# EAGLE design circuit (EAGLE 6.6.0)

## Sheet 1 of 3
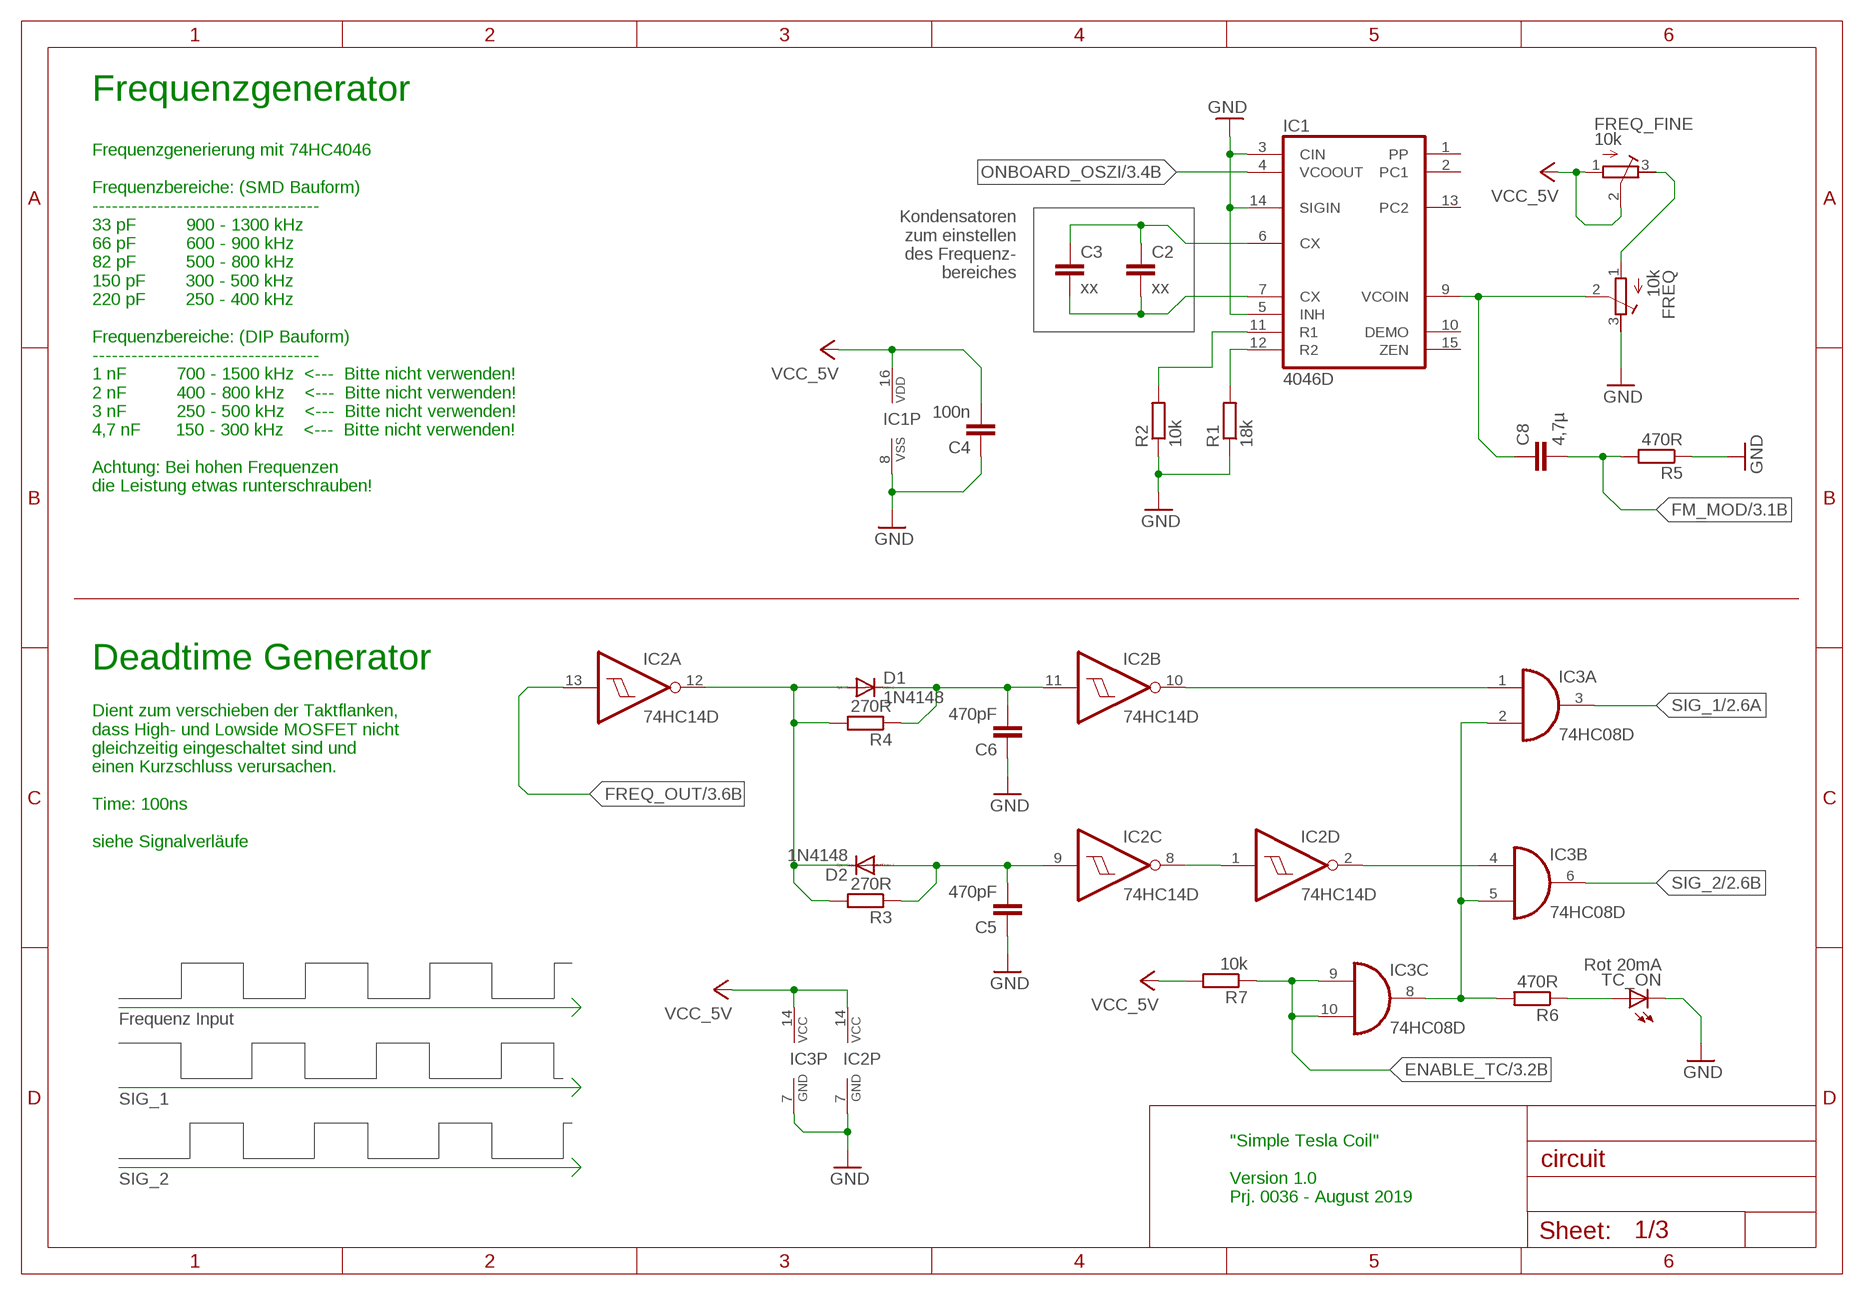
[diagram p0: schematic, sheet 1]

### Parts
C2  xx  C-EUC0805K  [C0805K]
C3  xx  C-EUC0805K  [C0805K]
C4  100n  C-EUC1206K  [C1206K]
C5  470pF  C-EUC1206K  [C1206K]
C6  470pF  C-EUC1206K  [C1206K]
C8  4,7µ  C-EUC1206K  [C1206K]
D1  1N4148  DIODE-SOD323-W  [SOD323-W]
D2  1N4148  DIODE-SOD323-W  [SOD323-W]
FREQ  10k  R-TRIMM64W  [RTRIM64W]
FREQ_FINE  10k  R-TRIMM64W  [RTRIM64W]
IC1  4046D  [SO16]
IC2  74HC14D  74HCT14D  [SO14]
IC3  74HC08D  [SO14]
R1  18k  R-EU_M1206  [M1206]
R2  10k  R-EU_M1206  [M1206]
R3  270R  R-EU_M1206  [M1206]
R4  270R  R-EU_M1206  [M1206]
R5  470R  R-EU_M1206  [M1206]
R6  470R  R-EU_M1206  [M1206]
R7  10k  R-EU_M1206  [M1206]
TC_ON  Rot 20mA  LEDSMT1206  [1206]

### Nets
ENABLE_TC: IC3.9(C:I0) IC3.10(C:I1) R7.1 ; also sheet 3
ENABLE_TC2: IC3.2(A:I1) IC3.5(B:I1) IC3.8(C:O) R6.2
FM_MOD: C8.2 R5.2 ; also sheet 3
FREQ_OUT: IC2.13(A:I) ; also sheet 3
GND: C4.1 C5.1 C6.1 FREQ.3(E) IC1.3(CIN) IC1.5(INH) IC1.8(VSS) IC1.14(SIGIN) IC2.7(P:GND) IC3.7(P:GND) R1.1 R2.1 R5.1 TC_ON.C ; also sheet 2,3
N$1: C2.1 C3.1 IC1.6(CX)
N$2: C2.2 C3.2 IC1.7(CX)
N$3: C5.2 D2.A IC2.9(C:I) R3.1
N$4: C8.1 FREQ.2(S) IC1.9(VCOIN)
N$5: R6.1 TC_ON.A
N$6: IC1.11(R1) R2.2
N$8: IC1.12(R2) R1.2
N$9: D1.A D2.C IC2.12(A:O) R3.2 R4.2
N$10: C6.2 D1.C IC2.11(B:I) R4.1
N$15: IC2.1(D:I) IC2.8(C:O)
N$16: IC2.2(D:O) IC3.4(B:I0)
N$17: IC2.10(B:O) IC3.1(A:I0)
N$18: FREQ.1(A) FREQ_FINE.3(E)
ONBOARD_OSZI: IC1.4(VCOOUT) ; also sheet 3
SIG_1: IC3.3(A:O) ; also sheet 2
SIG_2: IC3.6(B:O) ; also sheet 2
VCC: C4.2 FREQ_FINE.1(A) FREQ_FINE.2(S) IC1.16(VDD) IC2.14(P:VCC) IC3.14(P:VCC) R7.2 ; supply symbol labelled VCC_5V ; also sheet 2,3
Unconnected: IC1.1(PP) IC1.2(PC1) IC1.10(DEMO) IC1.13(PC2) IC1.15(ZEN) IC2.3(E:I) IC2.4(E:O) IC2.5(F:I) IC2.6(F:O) IC3.11(D:O) IC3.12(D:I0) IC3.13(D:I1)

### Notes on the sheet
- Frequenzgenerator
- Kondensatoren
  zum einstellen
  des Frequenz-
  bereiches
- Frequenzgenerierung mit 74HC4046
  
  Frequenzbereiche: (SMD Bauform)
  -----------------------------------
  33 pF          900 - 1300 kHz
  66 pF          600 - 900 kHz
  82 pF          500 - 800 kHz
  150 pF        300 - 500 kHz
  220 pF        250 - 400 kHz
  
  Frequenzbereiche: (DIP Bauform)
  -----------------------------------
  1 nF          700 - 1500 kHz  <---  Bitte nicht verwenden!
  2 nF          400 - 800 kHz    <---  Bitte nicht verwenden!
  3 nF          250 - 500 kHz    <---  Bitte nicht verwenden!
  4,7 nF       150 - 300 kHz    <---  Bitte nicht verwenden!
  
  Achtung: Bei hohen Frequenzen
  die Leistung etwas runterschrauben!
- Deadtime Generator
- Dient zum verschieben der Taktflanken,
  dass High- und Lowside MOSFET nicht
  gleichzeitig eingeschaltet sind und
  einen Kurzschluss verursachen.
  
  Time: 100ns
  
  siehe Signalverläufe
- Frequenz Input
- SIG_1
- SIG_2
- "Simple Tesla Coil"
  
  Version 1.0
  Prj. 0036 - August 2019

## Sheet 2 of 3
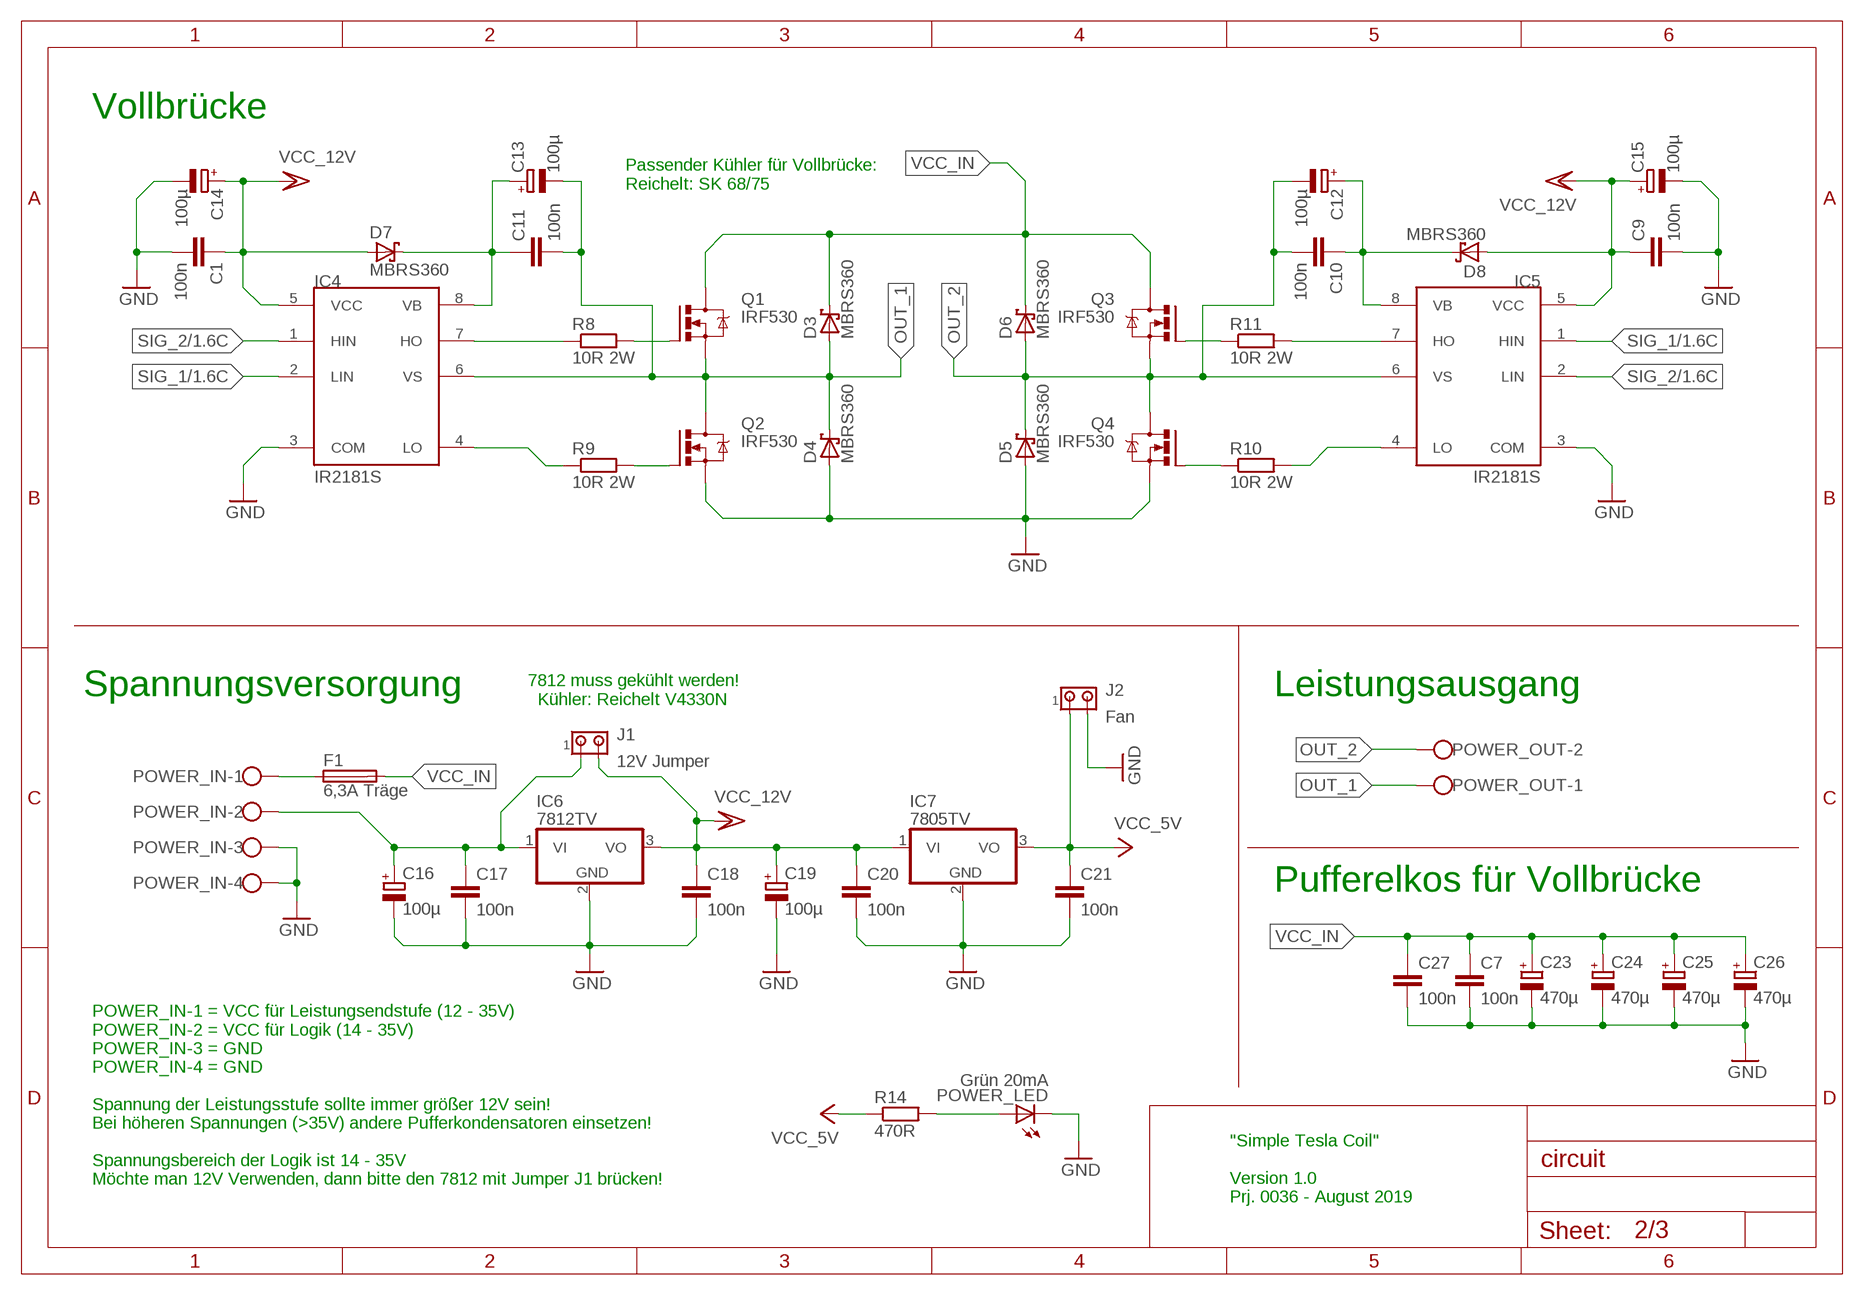
[diagram p1: schematic, sheet 2]

### Parts
C1  100n  C-EUC1206K  [C1206K]
C7  100n  C-EUC1206K  [C1206K]
C9  100n  C-EUC1206K  [C1206K]
C10  100n  C-EUC1206K  [C1206K]
C11  100n  C-EUC1206K  [C1206K]
C12  100µ  CPOL-EUE2.5-7  [E2,5-7]
C13  100µ  CPOL-EUE2.5-7  [E2,5-7]
C14  100µ  CPOL-EUE2.5-7  [E2,5-7]
C15  100µ  CPOL-EUE2.5-7  [E2,5-7]
C16  100µ  CPOL-EUE2.5-7  [E2,5-7]
C17  100n  C-EUC1206K  [C1206K]
C18  100n  C-EUC1206K  [C1206K]
C19  100µ  CPOL-EUE2.5-7  [E2,5-7]
C20  100n  C-EUC1206K  [C1206K]
C21  100n  C-EUC1206K  [C1206K]
C23  470µ  CPOL-EUE5-10.5  [E5-10,5]
C24  470µ  CPOL-EUE5-10.5  [E5-10,5]
C25  470µ  CPOL-EUE5-10.5  [E5-10,5]
C26  470µ  CPOL-EUE5-10.5  [E5-10,5]
C27  100n  C-EUC1206K  [C1206K]
D3  MBRS360  MBRS340T3  [SMC]
D4  MBRS360  MBRS340T3  [SMC]
D5  MBRS360  MBRS340T3  [SMC]
D6  MBRS360  MBRS340T3  [SMC]
D7  MBRS360  MBRS340T3  [SMC]
D8  MBRS360  MBRS340T3  [SMC]
F1  6,3A Träge  SH22,5  [SH22,5]
IC4  IR2181S  [SO08]
IC5  IR2181S  [SO08]
IC6  7812TV  [TO220V]
IC7  7805TV  [TO220V]
J1  12V Jumper  MTA02-100  [10X02MTA]
J2  Fan  MTA02-100  [10X02MTA]
POWER_IN  W237-4  [W237-4]
POWER_LED  Grün 20mA  LEDSMT1206  [1206]
POWER_OUT  W237-102  [W237-102]
Q1  IRF530  [TO220BV]
Q2  IRF530  [TO220BV]
Q3  IRF530  [TO220BV]
Q4  IRF530  [TO220BV]
R8  10R 2W  R-EU_0411/15  [0411/15]
R9  10R 2W  R-EU_0411/15  [0411/15]
R10  10R 2W  R-EU_0411/15  [0411/15]
R11  10R 2W  R-EU_0411/15  [0411/15]
R14  470R  R-EU_M1206  [M1206]

### Nets
GND: C1.2 C7.2 C9.2 C14.- C15.- C16.- C17.2 C18.2 C19.- C20.2 C21.2 C23.- C24.- C25.- C26.- C27.2 D4.A D5.A IC4.3(COM) IC5.3(COM) IC6.2(GND) IC7.2(GND) J2.2 POWER_IN.3 POWER_IN.4 POWER_LED.C Q2.S Q4.S ; also sheet 1,3
N$19: IC4.7(HO) R8.1
N$20: IC4.4(LO) R9.1
N$21: IC5.7(HO) R11.2
N$22: IC5.4(LO) R10.2
N$23: F1.1 POWER_IN.1
N$24: Q3.G R11.1
N$25: Q4.G R10.1
N$26: Q2.G R9.2
N$27: C16.+ C17.1 IC6.1(VI) J1.1 POWER_IN.2
N$28: POWER_LED.A R14.2
N$30: Q1.G R8.2
OUT_1: C11.2 C13.- D3.A D4.C IC4.6(VS) POWER_OUT.1 Q1.S Q2.D
OUT_2: C10.2 C12.- D5.C D6.A IC5.6(VS) POWER_OUT.2 Q3.S Q4.D
SIG_1: IC4.2(LIN) IC5.1(HIN) ; also sheet 1
SIG_2: IC4.1(HIN) IC5.2(LIN) ; also sheet 1
VB: C11.1 C13.+ D7.C IC4.8(VB)
VB_2: C10.1 C12.+ D8.C IC5.8(VB)
VCC: C21.1 IC7.3(VO) J2.1 R14.1 ; supply symbol labelled VCC_5V ; also sheet 1,3
VCC/2: C1.1 C9.1 C14.+ C15.+ C18.1 C19.+ C20.1 D7.A D8.A IC4.5(VCC) IC5.5(VCC) IC6.3(VO) IC7.1(VI) J1.2 ; supply symbol labelled VCC_12V ; also sheet 3
VCC_IN: C7.1 C23.+ C24.+ C25.+ C26.+ C27.1 D3.C D6.C F1.2 Q1.D Q3.D

### Notes on the sheet
- Vollbrücke
- Passender Kühler für Vollbrücke:
  Reichelt: SK 68/75
- Spannungsversorgung | Leistungsausgang
- 7812 muss gekühlt werden!
    Kühler: Reichelt V4330N
- Pufferelkos für Vollbrücke
- POWER_IN-1 = VCC für Leistungsendstufe (12 - 35V)
  POWER_IN-2 = VCC für Logik (14 - 35V)
  POWER_IN-3 = GND
  POWER_IN-4 = GND
  
  Spannung der Leistungsstufe sollte immer größer 12V sein!
  Bei höheren Spannungen (>35V) andere Pufferkondensatoren einsetzen!
   
  Spannungsbereich der Logik ist 14 - 35V
  Möchte man 12V Verwenden, dann bitte den 7812 mit Jumper J1 brücken!
- "Simple Tesla Coil"
  
  Version 1.0
  Prj. 0036 - August 2019

## Sheet 3 of 3
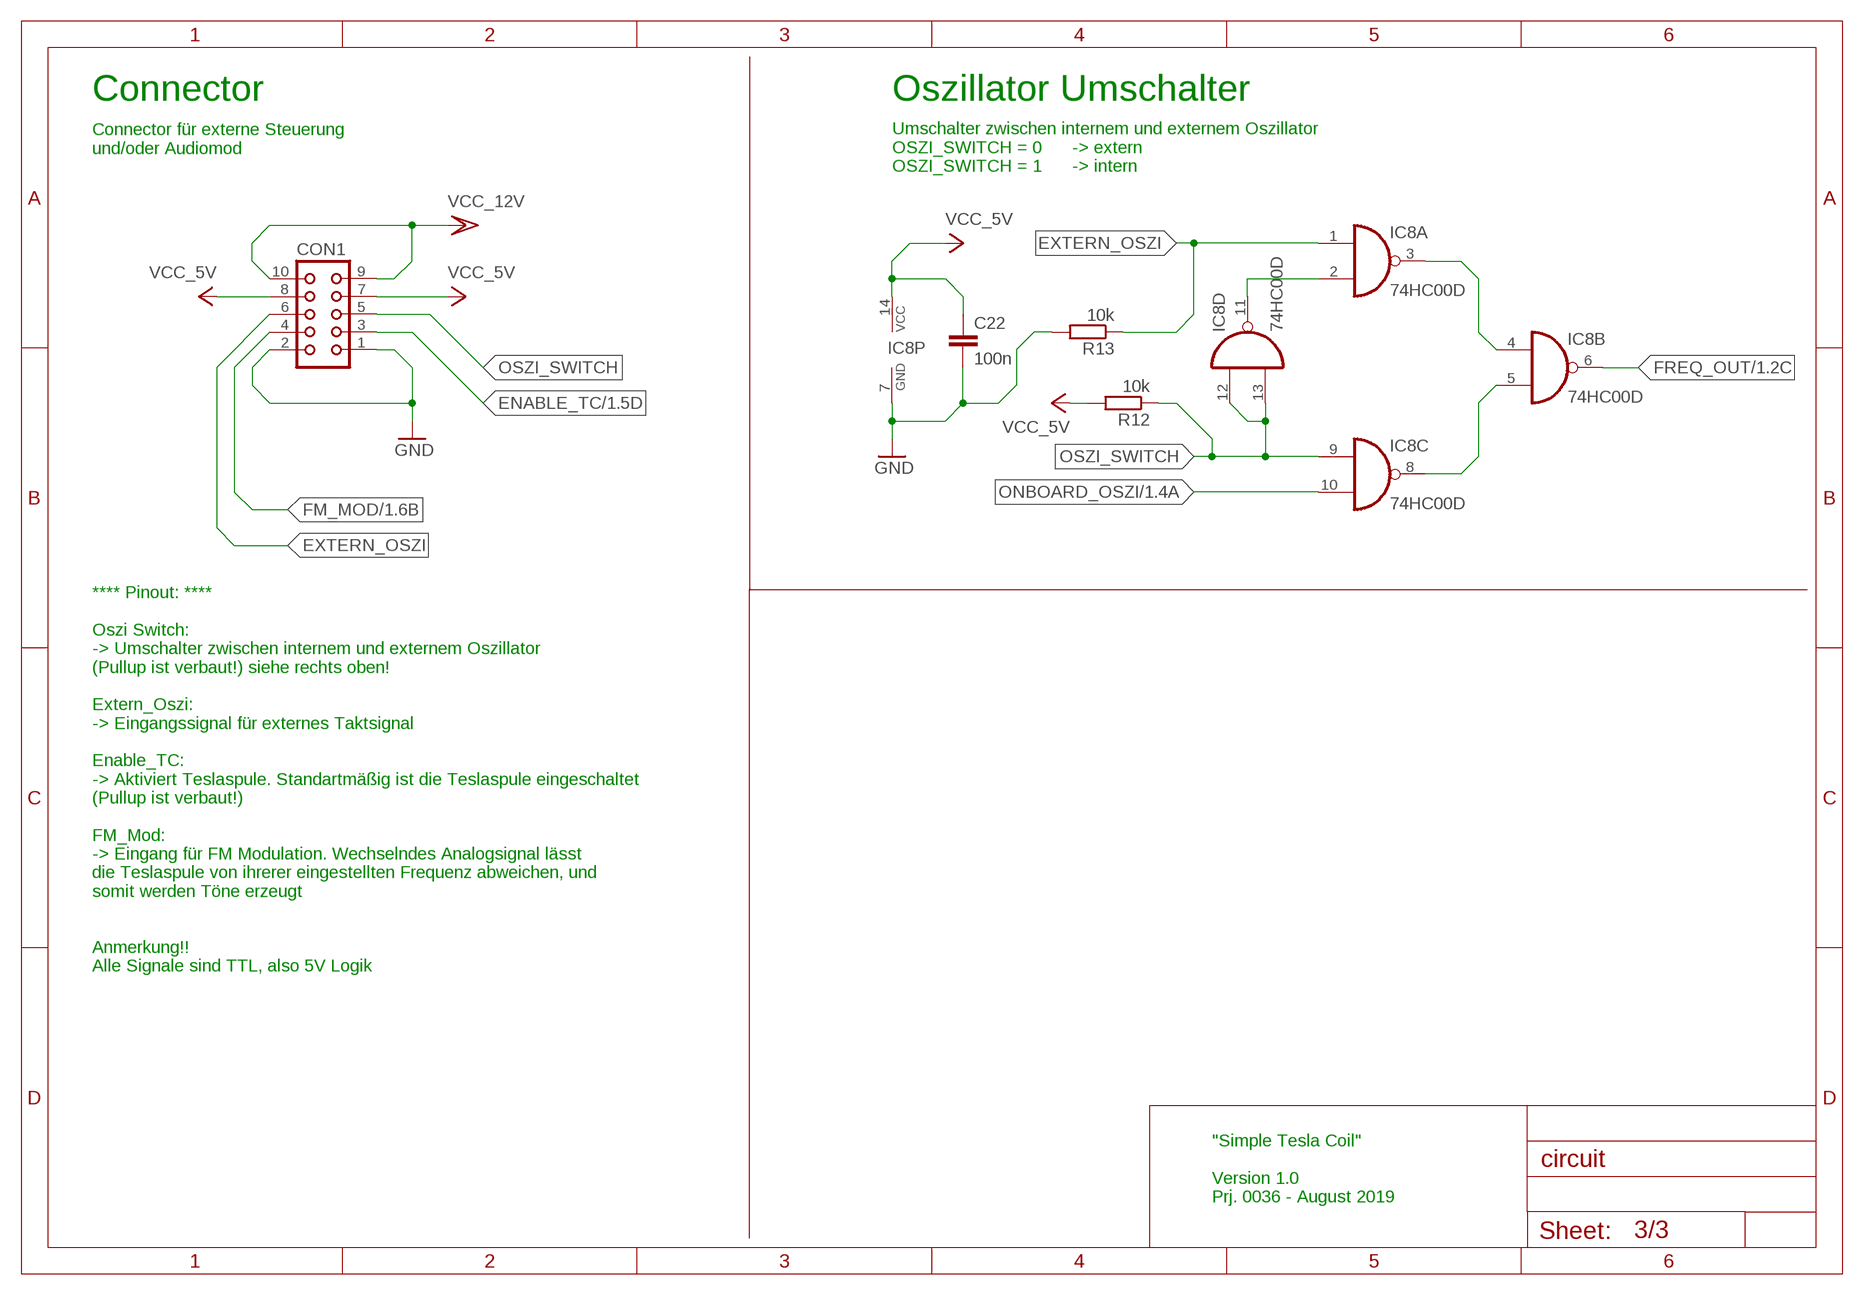
[diagram p2: schematic, sheet 3]

### Parts
C22  100n  C-EUC1206K  [C1206K]
CON1  CON10  [CON10]
IC8  74HC00D  [SO14]
R12  10k  R-EU_M1206  [M1206]
R13  10k  R-EU_M1206  [M1206]

### Nets
ENABLE_TC: CON1.3 ; also sheet 1
EXTERN_OSZI: CON1.6 IC8.1(A:I0) R13.1
FM_MOD: CON1.4 ; also sheet 1
FREQ_OUT: IC8.6(B:O) ; also sheet 1
GND: C22.2 CON1.1 CON1.2 IC8.7(P:GND) R13.2 ; also sheet 1,2
N$29: IC8.2(A:I1) IC8.11(D:O)
N$31: IC8.3(A:O) IC8.4(B:I0)
N$32: IC8.5(B:I1) IC8.8(C:O)
ONBOARD_OSZI: IC8.10(C:I1) ; also sheet 1
OSZI_SWITCH: CON1.5 IC8.9(C:I0) IC8.12(D:I0) IC8.13(D:I1) R12.1
VCC: C22.1 CON1.7 CON1.8 IC8.14(P:VCC) R12.2 ; supply symbol labelled VCC_5V ; also sheet 1,2
VCC/2: CON1.9 CON1.10 ; supply symbol labelled VCC_12V ; also sheet 2

### Notes on the sheet
- Connector | Oszillator Umschalter
- Connector für externe Steuerung
  und/oder Audiomod
- Umschalter zwischen internem und externem Oszillator
  OSZI_SWITCH = 0      -> extern
  OSZI_SWITCH = 1      -> intern
- **** Pinout: ****
  
  Oszi Switch:
  -> Umschalter zwischen internem und externem Oszillator
  (Pullup ist verbaut!) siehe rechts oben!
  
  Extern_Oszi:
  -> Eingangssignal für externes Taktsignal
  
  Enable_TC:
  -> Aktiviert Teslaspule. Standartmäßig ist die Teslaspule eingeschaltet 
  (Pullup ist verbaut!)
  
  FM_Mod:
  -> Eingang für FM Modulation. Wechselndes Analogsignal lässt
  die Teslaspule von ihrerer eingestellten Frequenz abweichen, und
  somit werden Töne erzeugt
  
  
  Anmerkung!!
  Alle Signale sind TTL, also 5V Logik
- "Simple Tesla Coil"
  
  Version 1.0
  Prj. 0036 - August 2019

## Library data of the parts
C1-C11 C17 C18 C20-C22 C27 = rcl:C-EU: CAPACITOR, European symbol
C12-C16 C19 C23-C26 = rcl:CPOL-EU: POLARIZED CAPACITOR, European symbol
CON1 = con-harting:CON10: CONNECTOR; OC_FARNELL: unknown; OC_NEWARK: unknown
D1 D2 = diode:DIODE-: DIODE
D3-D8 = diode:MBRS3*0T3: SCHOTTKY BARRIER RECTIFIER 3.0 AMPERES 20, 30, 40 VOLT Source: MBRS340T3-D.pdf
F1 = fuse:SH22,5: FUSE HOLDER grid 22,5 mm, OGN0031 8201, Schurter (Buerklin); MF: SCHURTER; MPN: 0031.8201; OC_FARNELL: 1162740; OC_NEWARK: 96F8317
FREQ FREQ_FINE = rcl:R-TRIMM: Trimm resistor
IC1 = 40xx:4046: Micropower PLL
IC2 = 74xx-eu:74*14: Hex schmitt trigger INVERTER
IC3 = 74xx-eu:74*08: Quad 2-input AND gate
IC4 IC5 = _irs:IR2181
IC6 IC7 = linear:78*: Positive VOLTAGE REGULATOR Source: http://cache.national.com/ds/LM/LM78L05.pdf http://www.fairchildsemi.com/ds/LM/LM7805.pdf
IC8 = 74xx-eu:74*00: Quad 2-input NAND gate
J1 J2 = con-amp:MTA02-100: AMP connector
POWER_IN = con-wago-500:W237-4: WAGO SCREW CLAMP; OC_FARNELL: unknown; OC_NEWARK: unknown
POWER_LED TC_ON = led:LED: LED OSRAM: - CHIPLED LG R971, LG N971, LY N971, LG Q971, LY Q971, LO R971, LY R971 LH N974, LH R974 LS Q976, LO Q976, LY Q976 LO Q996 - Hyper CHIPLED LW Q18S LB Q993, LB Q99A, LB R99A - SideLED LS A670, LO A670, LY A670, LG A670, LP A670 LB A673, LV A673, LT A673, LW A673 LH A674 LY A675 LS A676, LA A676, LO A676, LY A676, LW A676 LS A679, LY A679, LG A679 - Hyper Micro SIDELED® LS Y876, LA Y876, LO Y876, LY Y876 LT Y87S - SmartLED LW L88C, LW L88S LB L89C, LB L89S, LG L890 LS L89K, LO L89K, LY L89K LS L896, LA L896, LO L896, LY L896 - TOPLED LS T670, LO T670, LY T670, LG T670, LP T670 LSG T670, LSP T670, LSY T670, LOP T670, LYG T670 LG T671, LOG T671, LSG T671 LB T673, LV T673, LT T673, LW T673 LH T674 LS T676, LA T676, LO T676, LY T676, LB T676, LH T676, LSB T676, LW T676 LB T67C, LV T67C, LT T67C, LS T67K, LO T67K, LY T67K, LW E67C LS E67B, LA E67B, LO E67B, LY E67B, LB E67C, LV E67C, LT E67C LW T67C LS T679, LY T679, LG T679 LS T770, LO T770, LY T770, LG T770, LP T770 LB T773, LV T773, LT T773, LW T773 LH T774 LS E675, LA E675, LY E675, LS T675 LS T776, LA T776, LO T776, LY T776, LB T776 LHGB T686 LT T68C, LB T68C - Hyper Mini TOPLED® LB M676 - Mini TOPLED Santana® LG M470 LS M47K, LO M47K, LY M47K Source: http://www.osram.convergy.de LUXEON: - LUMILED® LXK2-PW12-R00, LXK2-PW12-S00, LXK2-PW14-U00, LXK2-PW14-V00 LXK2-PM12-R00, LXK2-PM12-S00, LXK2-PM14-U00 LXK2-PE12-Q00, LXK2-PE12-R00, LXK2-PE12-S00, LXK2-PE14-T00, LXK2-PE14-U00 LXK2-PB12-K00, LXK2-PB12-L00, LXK2-PB12-M00, LXK2-PB14-N00, LXK2-PB14-P00, LXK2-PB14-Q00 LXK2-PR12-L00, LXK2-PR12-M00, LXK2-PR14-Q00, LXK2-PR14-R00 LXK2-PD12-Q00, LXK2-PD12-R00, LXK2-PD12-S00 LXK2-PH12-R00, LXK2-PH12-S00 LXK2-PL12-P00, LXK2-PL12-Q00, LXK2-PL12-R00 Source: www.luxeon.com KINGBRIGHT: KA-3528ASYC Source: www.kingbright.com
POWER_OUT = con-wago-500:W237-102: WAGO SCREW CLAMP; MPN: 237-102; OC_FARNELL: unknown; OC_NEWARK: 70K9898
Q1-Q4 = transistor-power:IRF530: HEXFET Power MOSFET
R1-R14 = rcl:R-EU_: RESISTOR, European symbol

## Board
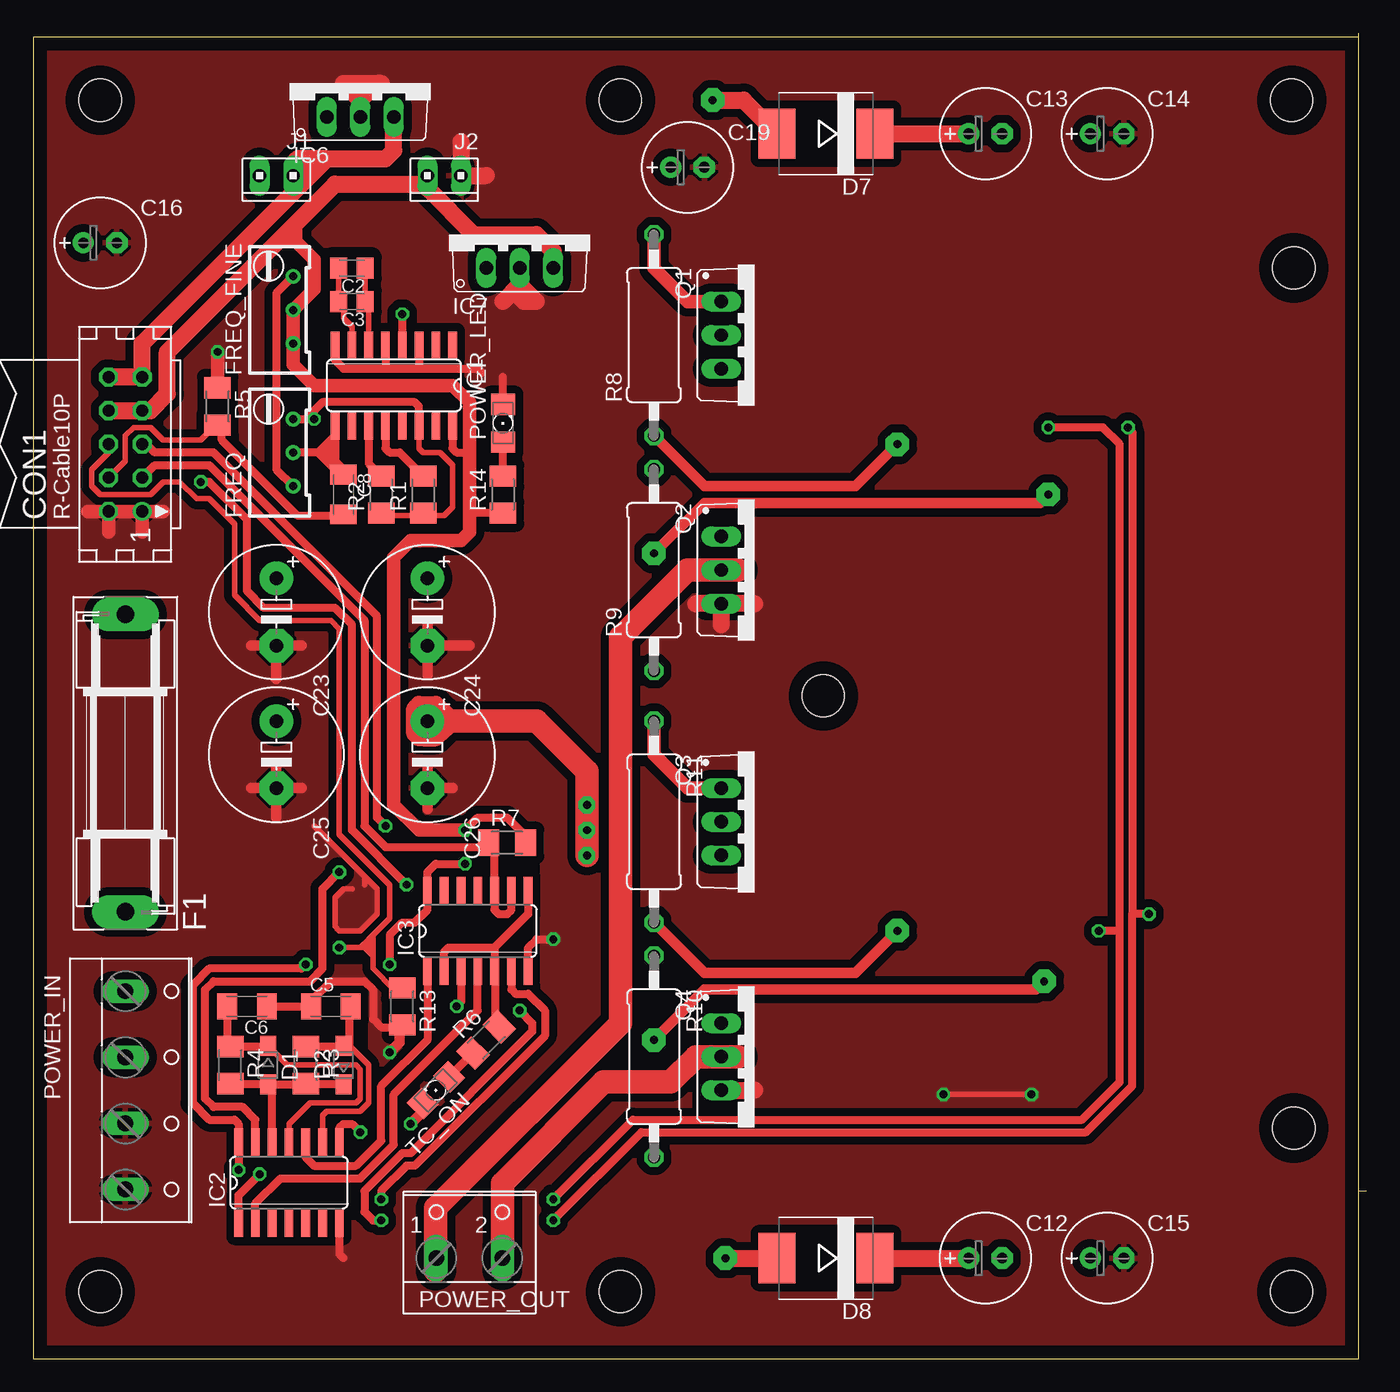
[diagram p3: board, top side]
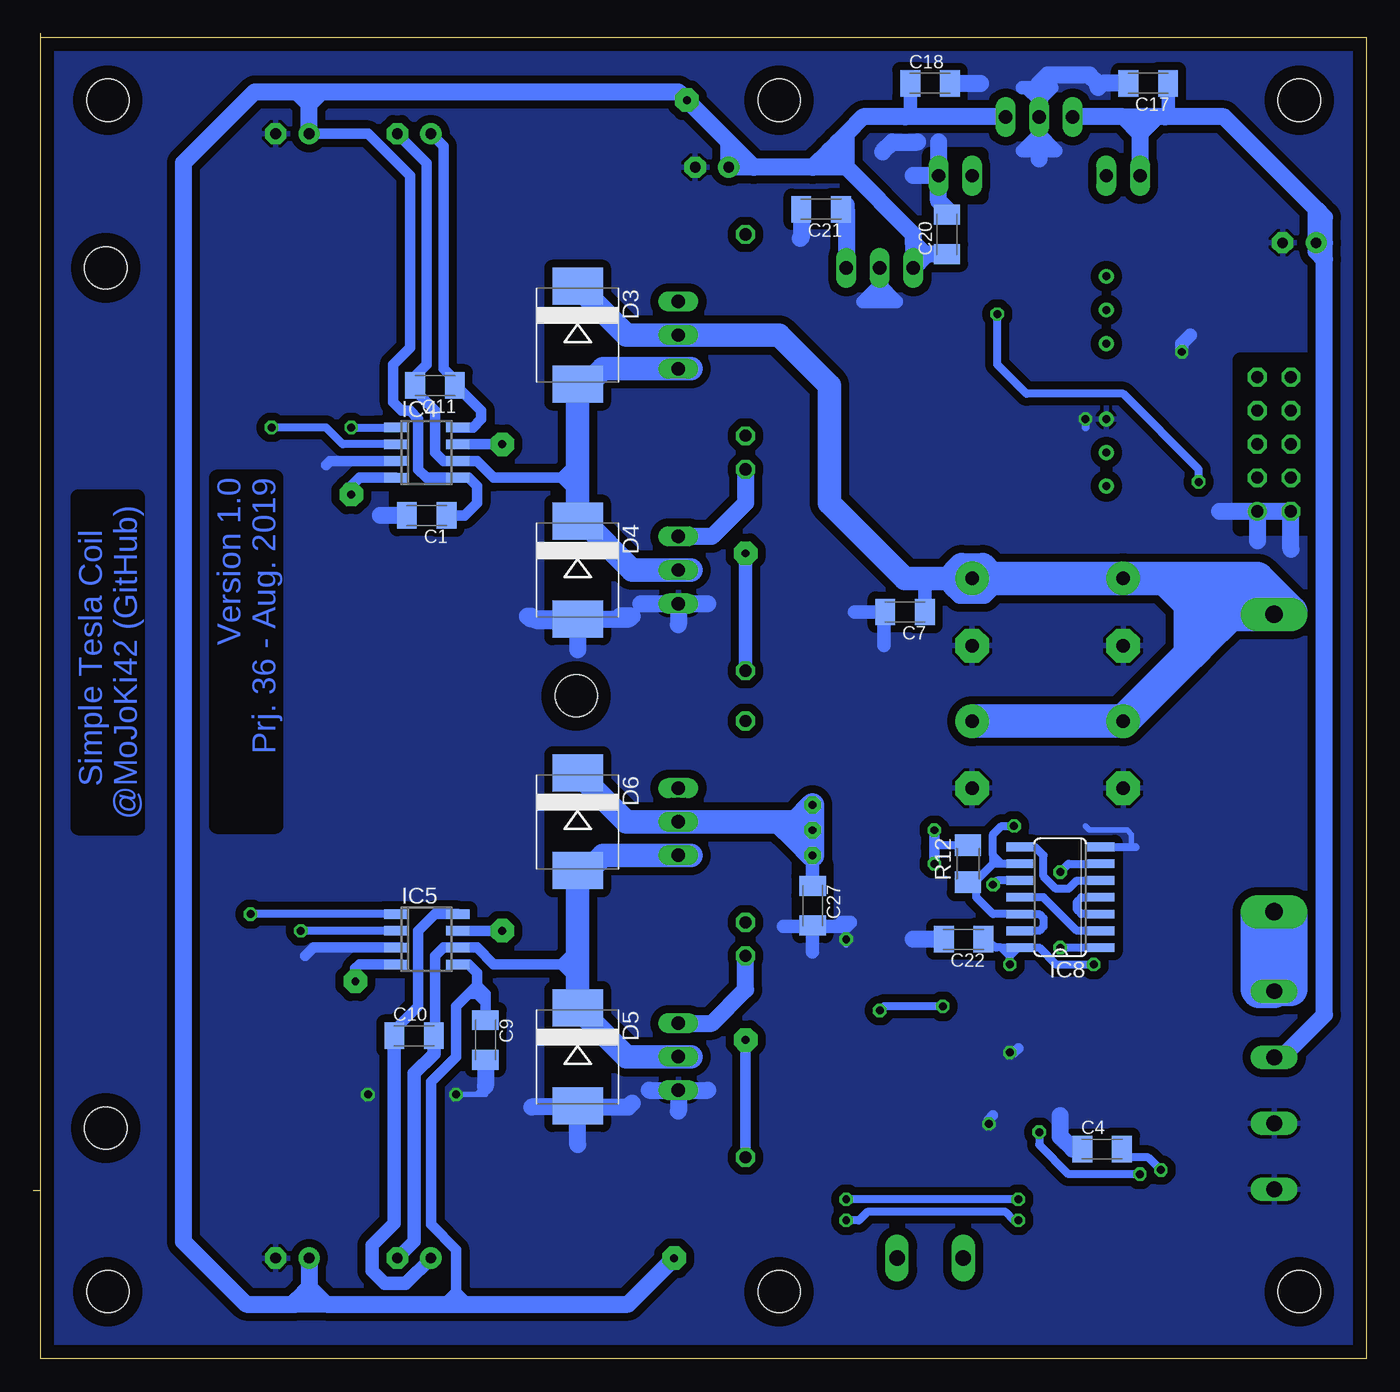
[diagram p4: board, bottom side, seen from below]

Size 100.91 x 100.33 mm. Coordinates in mm from the lower left corner, seen from the top.
Outline: 100.31,100 0,100 0,0 100.33,0 100.33,100.33
Outline: 100.91,12.7 100.33,12.7 100.33,87.7
Copper layers (1*16): Top 0.035mm / dielectric 1.5mm / Bottom 0.035mm
Design rules "default": minimum track width 10mil, minimum drill 24mil, track to track 8mil, track to pad 8mil, pad to pad 8mil, via to via 8mil, smd to smd 8mil, copper to edge 40mil, drill to drill 8mil, minimum pad ring 10mil, minimum via ring 8mil, stop-mask expansion 4mil, vias tented up to drill 0mil, thermal gap 10mil
Holes 3.2 mm at 5.08,95.25 5.08,5.08 95.25,5.08 95.25,95.25 44.45,5.08 44.45,95.25 95.41,82.55 95.41,17.46 59.81,50.16
tRestrict: area 22.5,69.5 to 32.1,77.8; area 33.7,81.3 to 40,83.8; area 50.8,74.3 to 53.3,80.6; area 50.8,56.5 to 53.3,62.9; area 50.8,37.5 to 53.3,43.8; area 50.8,19.7 to 53.3,26; area 21.6,92.7 to 27.9,95.2; area 29.5,28.3 to 37.8,36.5; area 15.2,9.2 to 23.5,17.5; area 54.9,90.8 to 65.1,94.6; area 54.9,5.7 to 65.1,9.5; area 13,69.8 to 14.9,74.3; 13 more areas
bRestrict: area 3.8,62.9 to 9.5,75.6; area 19.1,30.8 to 27.3,39.1; area 28.3,30.8 to 32.7,32.7; area 29.2,35.2 to 31.1,39.7; area 14.3,95.6 to 18.7,97.5; area 30.8,95.6 to 35.2,97.5; area 39.1,86 to 43.5,87.9; area 57.8,72.4 to 61.6,82.5; area 68.9,62.9 to 73.3,64.8; area 72.7,66.4 to 74.9,70.8; area 57.8,54.6 to 61.6,64.8; area 57.8,35.6 to 61.6,45.7; 13 more areas

### Footprints (pad centres in the part's own frame; a part is rotated, then mirrored left to right if it is on the bottom)
C1206K = smd 1.5 x 2: 1 -1.5,0; 2 1.5,0
C0805K = smd 1.3 x 1.6: 1 -1,0; 2 1,0
E2,5-7 = drill 0.813 pad 1.6: + -1.27,0 | drill 0.813 pad 1.6 octagon: - 1.27,0
E5-10,5 = drill 1.016 pad 2.54: + -2.54,0 | drill 1.016 pad 2.54 octagon: - 2.54,0
CON10 = drill 0.914: 1 -5.08,-1.27 | drill 0.914 octagon: 2 -5.08,1.27; 3 -2.54,-1.27; 4 -2.54,1.27; 5 0,-1.27; 6 0,1.27; 7 2.54,-1.27; 8 2.54,1.27; 9 5.08,-1.27; 10 5.08,1.27
SOD323-W = smd 1.5 x 1.2: A 1.45,0; C -1.45,0
SMC = smd 2.8 x 3.8: A 3.7,0; C -3.7,0
SH22,5 = drill 1.321 pad 2.54 long: 1 -11.252,0; 2 11.252,0
RTRIM64W = drill 0.61: 1 1.27,-2.54; 2 1.27,0; 3 1.27,2.54
SO16 = smd 0.66 x 2.032: 1 -4.445,-3.073; 2 -3.175,-3.073; 3 -1.905,-3.073; 4 -0.635,-3.073; 5 0.635,-3.073; 6 1.905,-3.073; 7 3.175,-3.073; 8 4.445,-3.073; 9 4.445,3.073; 10 3.175,3.073; 11 1.905,3.073; 12 0.635,3.073; 13 -0.635,3.073; 14 -1.905,3.073; 15 -3.175,3.073; 16 -4.445,3.073
SO14 = smd 0.66 x 2.032: 1 -3.81,-3.073; 2 -2.54,-3.073; 3 -1.27,-3.073; 4 0,-3.073; 5 1.27,-3.073; 6 2.54,-3.073; 7 3.81,-3.073; 8 3.81,3.073; 9 2.54,3.073; 10 1.27,3.073; 11 0,3.073; 12 -1.27,3.073; 13 -2.54,3.073; 14 -3.81,3.073
SO08 = smd 0.72 x 1.78: 1 -1.905,-2.35; 2 -0.635,-2.35; 3 0.635,-2.35; 4 1.905,-2.35; 5 1.905,2.35; 6 0.635,2.35; 7 -0.635,2.35; 8 -1.905,2.35
TO220V = drill 1.016 long: 1 -2.54,-2.54; 2 0,-2.54; 3 2.54,-2.54
10X02MTA = drill 1.016 long: 1 1.27,0; 2 -1.27,0
W237-4 = drill 1.194 long: 1 -7.5,-1.27; 2 -2.5,-1.27; 3 2.5,-1.27; 4 7.5,-1.27
1206 = smd 1.6 x 1.803: A -1.422,0; C 1.422,0
W237-102 = drill 1.194 long: 1 -2.5,-1.27; 2 2.5,-1.27
TO220BV = drill 1.016 long: D 0,-2.54; G -2.54,-2.54; S 2.54,-2.54
M1206 = smd 1.6 x 2: 1 -1.4,0; 2 1.4,0
0411/15 = drill 0.914 octagon: 1 -7.62,0; 2 7.62,0

### Placement (x,y rotation side)
C1  71.12,63.82 180 bottom
C2  24.13,82.55 180 top
C3  24.13,80.01 180 top
C4  20,15.88 0 bottom
C5  22.54,26.67 0 top
C6  16.19,26.67 180 top
C7  34.92,56.52 180 bottom
C8  23.5,65.41 270 top
C9  66.67,24.13 270 bottom
C10  72.07,24.45 0 bottom
C11  70.48,73.66 180 bottom
C12  72.07,7.62 0 top
C13  72.07,92.71 0 top
C14  81.28,92.71 0 top
C15  81.28,7.62 0 top
C16  5.08,84.45 0 top
C17  16.51,96.52 180 bottom
C18  33.02,96.52 0 bottom
C19  49.53,90.17 0 top
C20  31.75,85.09 90 bottom
C21  41.27,87 180 bottom
C22  30.48,31.75 180 bottom
C23  18.41,56.52 270 top
C24  29.84,56.52 270 top
C25  18.41,45.72 270 top
C26  29.84,45.72 270 top
C27  41.91,34.29 270 bottom
CON1  6.99,69.22 90 top
D1  17.78,22.23 270 top
D2  23.5,22.23 90 top
D3  59.69,77.47 270 bottom
D4  59.69,59.69 270 bottom
D5  59.69,22.86 270 bottom
D6  59.69,40.64 270 bottom
D7  60.01,92.71 180 top
D8  60.01,7.62 180 top
F1  6.99,45.09 90 top
FREQ  18.41,68.58 0 top
FREQ_FINE  18.41,79.38 0 top
IC1  27.3,73.66 180 top
IC2  19.37,13.34 0 top
IC3  33.66,32.38 0 top
IC4  71.12,68.58 270 bottom
IC5  71.12,31.75 270 bottom
IC6  24.77,96.52 0 top
IC7  36.83,85.09 0 top
IC8  23.18,34.92 90 bottom
J1  18.41,89.53 180 top
J2  31.11,89.53 180 top
POWER_IN  8.26,20.32 270 top
POWER_LED  35.56,70.8 90 top
POWER_OUT  33.02,8.89 0 top
Q1  54.61,77.47 270 top
Q2  54.61,59.69 270 top
Q3  54.61,40.64 270 top
Q4  54.61,22.86 270 top
R1  29.53,65.41 90 top
R2  26.35,65.41 90 top
R3  20.64,22.23 270 top
R4  14.92,22.23 270 top
R5  13.97,72.07 270 top
R6  34.29,24.13 45 top
R7  35.88,39.05 0 top
R8  46.99,77.47 90 top
R9  46.99,59.69 90 top
R10  46.99,22.86 270 top
R11  46.99,40.64 270 top
R12  30.16,37.47 90 bottom
R13  27.94,26.67 270 top
R14  35.56,65.41 90 top
TC_ON  30.48,20.32 225 top

### Tracks (layer width: path | path; a pad name or v marks a point on that pad's centre or on a via)
ENABLE_TC
  Top 0.61: IC3.9 36.2,33.97 35.88,33.66 35.24,33.66 34.92,33.97 IC3.10 34.92,38.42 | 34.92,38.42 34.92,38.6 R7.1 | 34.92,38.42 34.61,38.73 26.67,38.73 25.08,40.32 25.08,55.88 13.34,67.63 9.21,67.63 CON1.3
ENABLE_TC2
  Top 0.61: IC3.8 37.47,33.66 34.92,31.11 | 34.92,31.11 IC3.5 34.96,29.27 34.96,25.12 R6.2 | IC3.2 31.11,30.8 31.43,31.11 34.92,31.11
EXTERN_OSZI  (via drill 0.6)
  Top 0.406: CON1.6 5.71,68.58 4.45,67.31 4.45,66.04 5.08,65.41 8.89,65.41 9.84,66.36 11.11,66.36 12.38,65.09 13.34,65.09 15.24,63.18 15.24,57.78 17.14,55.88 22.54,55.88 23.18,55.24 23.18,39.69 26.99,35.88 26.99,33.34 25.72,32.07 | 25.72,31.11 25.4,31.11 | 25.08,31.11 24.77,31.11 | 24.77,31.11 v23.18,31.11 | 25.72,30.48 25.72,31.11 | 25.72,31.75 25.72,32.07 | 25.08,31.11 25.72,31.75 | 25.72,31.75 25.72,31.11 | 25.72,30.48 25.08,31.11 | 25.08,31.11 25.4,31.11 | 25.4,31.11 25.4,31.75 | 25.4,31.75 25.72,32.07 | 25.4,31.75 24.77,31.11 | 25.72,30.48 25.72,29.53 27.3,27.94 27.81,27.94 R13.1
  Bottom 0.61: v23.18,31.11 IC8.1
FM_MOD
  Top 0.406: CON1.4 6.99,67.94 6.99,69.85 7.62,70.48 8.89,70.48 9.84,69.53 12.7,69.53 13.34,70.17 13.46,70.17 R5.2 13.78,70.48
  Top 0.61: 14.42,70.67 R5.2 14.29,70.36 14.29,69.53 20,63.82 23.41,63.82 C8.2
FREQ_OUT  (via drill 0.6)
  Top 0.61: IC2.13 16.83,18.1 15.88,19.05 13.65,19.05 13.02,19.68 13.02,27.94 13.65,28.57 20.95,28.57 21.91,29.53 21.91,35.56 v23.18,36.83
  Bottom 0.61: v23.18,36.83 22.54,37.47 IC8.6
GND  (via drill 0.6)
  Top 0.406: R13.2 27.75,25.27 | 21.27,27.3 21.27,26.9 C5.1 | IC1.14 29.21,68.9 29.53,68.58 30.8,68.58 31.75,67.63 31.75,64.45 31.11,63.82 30.16,63.82 | 30.16,63.82 26.54,63.82 R2.1 | R1.1 29.98,64 30.16,63.82 | v68.9,20 v75.56,20 | 21.27,40.32 25.08,36.51 | 25.08,36.51 25.08,35.88 | 25.08,36.51 26.04,35.56 26.04,33.66 24.77,32.38 23.18,32.38 22.86,32.7 22.86,34.92 23.5,35.56 24.13,35.56
  Top 0.61: C6.1 C5.1 | 21.27,27.3 22.54,28.57 25.08,28.57 25.72,27.94 25.72,25.72 26.35,25.08 27.75,25.08 R13.2 | FREQ.3 20.64,71.12 | IC1.8 22.86,75.56 23.5,74.93 26.67,74.93 | 26.67,74.93 29.21,74.93 | 29.21,74.93 33.66,74.93 33.97,74.61 | IC1.3 29.21,74.93 | IC1.5 26.67,74.93 | POWER_LED.C 35.56,74.3 | IC1.14 29.21,72.07 28.89,72.39 21.91,72.39 21.27,71.75 | IC2.7 23.18,7.94 23.5,7.62 | 21.27,71.75 20.64,71.12 | 20.64,71.12 v21.27,71.12 21.27,71.75 | IC3.7 37.47,31.11 38.1,31.75 v39.37,31.75
  Top 0.813: 27.75,25.08 27.75,23.94 v26.99,23.18 | TC_ON.C 29.47,18.68 v28.57,17.78 | 29.84,41.59 C26.- | C26.- 29.84,45.09 | C26.- 31.75,43.18 | 16.51,43.18 20.32,43.18 | 18.41,40.96 18.41,45.09 | 16.51,53.98 C23.- | C23.- 20.32,53.98 | C24.- 33.02,53.98 | 29.84,51.75 C24.- | C24.- 29.84,55.88 | 18.41,51.44 C23.-
  Top 1.016: R5.1 v13.97,76.2 | CON1.2 4.13,64.14 | 9.84,64.14 CON1.1 | 8.26,62.55 CON1.1 | CON1.1 CON1.2 | CON1.2 5.71,62.55
  Top 1.27: IC6.2 24.77,95.25 | 24.77,96.52 24.77,95.25 | 24.77,95.25 23.5,96.52 26.04,96.52 | 26.35,96.52 26.04,96.52 | 26.04,96.52 24.77,95.25 | IC7.2 36.83,81.28 | 35.56,80.01 36.83,81.28 | 36.83,81.28 38.1,80.01 37.15,80.01 36.83,80.33 | Q2.S 50.16,57.15 | 54.61,57.15 Q2.S | Q2.S 52.07,55.56 | Q4.S 54.61,20.32 | 32.38,92.08 J2.2 34.29,89.53
  Bottom 0.406: 66.67,22.23 66.67,20 67.31,20 | 66.67,22.54 66.67,20.64 67.31,20 | 67.31,20 v68.9,20 | 17.78,38.73 17.78,39.69 18.1,40.01 20.95,40.01 21.27,40.32
  Bottom 0.61: IC8.7 17.78,38.73 17.46,38.73 | v21.27,71.12 21.27,70.48 | v39.37,31.75 39.37,31.43
  Bottom 0.813: 73.03,67.94 IC4.3 78.42,67.94 78.74,67.63 | 73.03,31.11 IC5.3 79.69,31.11 80.33,30.48 | 36.83,81.28 36.83,80.64 | v26.99,23.18 26.67,23.18 26.35,23.5 | v28.57,17.78 28.57,18.1 28.26,18.41
  Bottom 1.016: v13.97,76.2 13.97,76.83 13.34,77.47 | 24.77,92.71 26.04,91.44 23.5,91.44 24.77,92.71 | 24.77,92.71 24.77,95.25 | 24.77,95.25 23.81,96.2 25.72,96.2 | 26.04,96.2 25.72,96.2 | 25.72,96.2 24.77,95.25 | C7.2 36.51,56.52 | 38.73,56.52 36.51,56.52 | 36.51,56.52 36.51,56.2 | 36.51,53.98 36.51,56.2 | 36.51,56.2 36.2,56.52 | C27.2 41.91,32.7 | 41.91,30.8 41.91,32.7 | 41.91,32.7 40.01,32.7 | 40.01,32.7 39.37,32.7 39.05,33.02 39.69,33.02 40.01,32.7 | 41.91,32.7 44.13,32.7 | 36.83,81.28 35.56,80.01 38.1,80.01 36.83,81.28
  Bottom 1.27: CON1.1 11.11,64.14 | 5.71,61.28 CON1.2 CON1.1 | CON1.1 8.26,61.91 | C17.2 20,96.52 20.32,96.2 20.32,96.52 20.95,97.16 24.13,97.16 24.77,96.52 24.77,95.25 IC6.2 24.77,92.71 24.77,90.81 | C18.2 29.21,96.52 | 36.62,91.33 35.88,92.08 33.97,92.08 | C21.2 42.77,84.86 42.86,84.77 | C22.2 34.29,31.75 | C4.1 22.23,15.88 23.18,16.83 23.18,18.41 | D5.A 59.69,19.05 | 59.69,16.19 59.69,19.05 | 59.69,19.05 63.18,19.05 | 59.69,19.05 55.88,19.05 55.56,19.37 | 56.52,56.2 55.56,56.2 55.77,55.99 D4.A 63.29,55.99 63.5,56.2 63.18,56.2 62.87,55.88 60.01,55.88 59.69,56.2 59.69,53.66 | C1.2 74.61,63.82 | C9.2 66.67,22.54 66.67,22.23 66.67,20.64 | Q4.S 49.85,20.32 | 54.29,20.32 Q4.S | Q4.S 52.07,18.73 | Q2.S 49.85,57.15 | 54.93,57.15 Q2.S | Q2.S 52.07,55.56 | IC7.2 36.83,81.28 36.83,80.33 | C20.2 31.75,87 32.38,87.63 J2.2 | 32.38,92.08 J2.2 | J2.2 34.29,89.53
  pour Bottom (isolate 0.61): 0,100.01 100.33,100.01 100.33,0 0,0
  pour Top (isolate 0.61): 0,100.01 100.33,100.01 100.33,0 0,0
N$1
  Top 0.406: IC1.6 25.4,79.74 C3.1 C2.1
N$2
  Top 0.406: IC1.7 24.13,78.11 23.5,78.74 23.5,79.64 C3.2 C2.2
N$3
  Top 0.406: IC2.9 21.91,18.41 22.23,18.73 24.77,18.73 25.4,19.37 25.4,22.23 23.95,23.68 D2.A
  Top 0.61: R3.1 23.45,23.62 D2.A | 23.95,23.68 23.95,26.58 C5.2
N$4
  Top 0.61: IC1.9 22.86,69.85 | 22.86,69.85 22.86,69.22 | 22.86,69.22 22.86,67.94 | C8.1 22.86,67.54 22.86,67.94 | 22.86,67.94 22.23,68.58 22.86,69.22 | 22.86,67.94 23.5,67.31 22.86,67.31 21.59,68.58 | 22.86,69.85 21.59,68.58 | 21.59,68.58 FREQ.2
N$5
  Top 0.61: TC_ON.A R6.1
N$6
  Top 0.61: IC1.11 25.4,67.76 R2.2
N$8
  Top 0.61: IC1.12 26.67,68.9 26.99,68.58 27.75,68.58 R1.2
N$9
  Top 0.61: IC2.12 18.1,20.46 D1.A | R4.2 17.73,20.82 D1.A | D1.A 20.59,20.77 R3.2 23.45,20.82 D2.C
N$10
  Top 0.406: D1.C 19.23,22.23 24.45,22.23 24.77,21.91 24.77,19.68 24.45,19.37 20.95,19.37 19.37,17.78 IC2.11
  Top 0.61: D1.C 17.73,23.62 R4.1 14.69,23.86 C6.2
N$13
  Top 1.27: 28.89,48.9 28.89,49.21 29.21,49.53 30.48,49.53 31.43,48.58 31.43,47.94 30.8,47.31 | 30.8,47.31 29.21,47.31 | 29.21,47.31 28.89,47.62 | 28.89,47.62 28.89,48.26 28.89,48.9 | 28.89,48.9 29.84,48.9 30.16,48.58 | 29.21,47.31 29.53,46.99 | 29.53,46.99 30.48,46.99 30.8,47.31 | 29.53,46.99 29.21,46.99 28.89,47.31 28.89,47.62
N$15  (via drill 0.6)
  Top 0.61: IC2.1 15.56,12.38 v17.14,13.97 | IC2.8 23.18,17.46 23.5,17.78 24.13,17.78 v24.77,17.14
  Bottom 0.61: v17.14,13.97 22.54,13.97 24.77,16.19 v24.77,17.14
N$16
  Top 0.61: IC2.2 16.83,11.75 18.73,13.65 24.77,13.65 27.3,16.19 27.3,20 33.66,26.35 IC3.4
N$17
  Top 0.61: IC2.10 20.64,15.24 21.27,14.61 24.45,14.61 26.35,16.51 26.35,20.64 29.84,24.13 IC3.1
N$18
  Top 0.61: FREQ_FINE.3 18.41,80.64 18.41,67.31 FREQ.1
N$19  (via drill 0.6 pad 1.78)
  Top 0.813: R8.1 50.8,66.04 62.23,66.04 v65.41,69.22
  Bottom 0.813: v65.41,69.22 IC4.7 69.22,69.22
N$20  (via drill 0.6 pad 1.78)
  Top 0.813: v76.83,65.41 76.2,64.77 50.8,64.77 v46.99,60.96
  Bottom 0.813: v76.83,65.41 76.83,66.04 76.2,66.67 IC4.4
  Bottom 1.016: R9.1 v46.99,60.96
N$21  (via drill 0.6 pad 1.78)
  Top 0.813: R11.2 50.8,29.21 62.23,29.21 v65.41,32.38
  Bottom 0.813: v65.41,32.38 IC5.7 69.22,32.38
N$22  (via drill 0.6 pad 1.78)
  Top 0.813: v46.99,24.13 50.8,27.94 75.88,27.94 v76.52,28.57
  Bottom 0.813: v46.99,24.13 R10.2 | v76.52,28.57 76.52,29.53 76.2,29.84 IC5.4 73.03,29.84
N$23
  Bottom 2.54: POWER_IN.1 8.13,27.82 8.26,27.94 | 7.62,27.94 5.71,27.94 5.71,33.66 8.26,33.66 8.26,27.94 | 8.26,27.94 7.62,27.94 | 7.62,27.94 6.99,28.57 F1.1
N$24
  Top 1.016: Q3.G 49.53,43.18 46.99,45.72 R11.1
N$25
  Bottom 1.27: Q4.G 49.53,25.4 46.99,27.94 R10.1
N$26
  Bottom 1.27: R9.2 46.99,64.77 49.53,62.23 Q2.G
N$27
  Bottom 1.016: C17.1 15.01,94.21 15.24,93.98
  Bottom 1.27: POWER_IN.2 6.39,22.82 3.17,26.04 3.17,83.19 | 3.81,87 3.17,86.36 3.17,84.45 3.17,83.19 | 3.81,87 10.79,93.98 15.24,93.98 15.88,93.98 | 15.88,93.98 17.14,93.98 | 18.41,93.98 IC6.1 | 15.88,93.98 17.14,92.71 18.41,93.98 | 18.41,93.98 17.14,93.98 | 17.14,93.98 J1.1 | 3.81,87 C16.+ 3.81,83.82 3.17,83.19
N$28
  Top 0.61: R14.2 POWER_LED.A
N$29
  Bottom 0.61: IC8.2 21.91,32.38 24.45,34.92 IC8.11
N$30
  Top 1.016: R8.2 46.99,82.55 49.53,80.01 Q1.G
N$31
  Bottom 0.61: IC8.3 21.59,33.66 21.91,33.97 21.91,34.61 21.59,34.92 IC8.4
N$32
  Bottom 0.61: IC8.8 25.08,38.73 24.45,38.1 24.45,36.51 23.5,35.56 22.54,35.56 21.91,36.2 IC8.5
ONBOARD_OSZI  (via drill 0.6)
  Top 0.61: v27.94,79.06 IC1.4 | v12.7,66.36 13.34,66.36 16.19,63.5 16.19,58.1 17.46,56.83 22.86,56.83 24.13,55.56 24.13,40.01 v28.26,35.88
  Bottom 0.61: IC8.10 27.94,36.2 v28.26,35.88 | v12.7,66.36 12.7,67.31 18.41,73.03 25.72,73.03 27.94,75.25 v27.94,79.06
OSZI_SWITCH  (via drill 0.6)
  Top 0.61: CON1.5 8.57,69.22 9.21,68.58 13.65,68.58 26.04,56.2 26.04,40.96 v26.67,40.32
  Bottom 0.61: IC8.13 24.77,32.38 24.45,32.7 24.45,33.34 24.77,33.66 IC8.12 28.26,33.66 29.53,34.92 29.53,35.56 29.66,35.56 R12.1 30.03,36.2 29.53,36.2 28.26,37.47 | IC8.9 27.62,37.47 | 27.62,37.47 28.26,38.1 | 28.26,38.1 28.26,39.69 27.62,40.32 v26.67,40.32 | 28.26,38.1 28.26,37.47 | 27.62,37.47 28.26,37.47
OUT_1
  Top 1.778: 53.34,59.69 Q2.D 49.53,59.69 44.45,54.61 44.45,25.4 30.48,11.43 30.48,7.58 | 30.48,6.67 30.48,7.58 | 30.48,7.58 POWER_OUT.1
  Bottom 0.813: 59.69,68.58 59.69,67.94 60.96,66.67 59.69,65.41 59.69,66.04 60.33,66.67 66.04,66.67 67.31,67.94 IC4.6 69.85,67.94 70.48,68.58 70.48,71.75 71.75,73.03 71.75,73.43 C11.2 71.98,74.38 71.12,75.25 71.12,90.49 C13.-
  Bottom 1.27: D3.A 59.69,73.66 59.05,73.66 58.42,73.66 | 59.69,65.41 59.69,68.58
  Bottom 1.778: 51.12,74.93 Q1.S 57.78,74.93 59.05,73.66 | 51.12,59.69 Q2.D 55.56,59.69 59.26,63.39 D4.C 59.69,65.41 D3.A
OUT_2
  Top 1.778: 53.34,22.86 Q4.D 50.16,22.86 48.26,20.95 43.18,20.95 35.52,13.29 POWER_OUT.2
  Bottom 0.813: 59.69,30.48 60.33,30.48 | 60.33,30.48 60.96,29.84 59.69,28.57 | 59.69,31.11 60.33,30.48 | 59.69,29.84 66.04,29.84 67.31,31.11 IC5.6 69.85,31.11 70.48,30.48 70.48,24.54 C10.2
  Bottom 1.016: C10.2 70.57,23.09 72.07,21.59 72.07,8.89 C12.-
  Bottom 1.27: 58.42,36.83 59.58,36.83 D6.A | 59.69,28.57 59.69,29.84 59.69,30.48 59.69,31.11
  Bottom 1.778: 51.12,22.86 Q4.D 55.99,22.86 D5.C 59.69,28.57 59.69,36.2 | 59.69,36.2 D6.A | 51.12,38.1 Q3.S 57.78,38.1 59.69,36.2
SIG_1  (via drill 0.6)
  Top 0.61: IC3.3 32.38,26.99 v32.07,26.67 | v36.83,26.35 37.78,25.4 37.78,24.77 28.57,15.56 27.94,15.56 25.08,12.7 25.08,11.11 25.72,10.48 v26.35,10.48 | v39.37,10.48 46.04,17.14 79.69,17.14 83.19,20.64 83.19,33.66 | v84.45,33.66 83.19,33.66 | v82.87,70.48 83.19,70.17 83.19,33.66
  Bottom 0.61: v32.07,26.67 36.51,26.67 v36.83,26.35 | v26.35,10.48 26.67,10.48 27.3,11.11 37.78,11.11 38.42,10.48 v39.37,10.48 | IC5.1 v84.45,33.66 | IC4.2 77.47,69.22 78.74,70.48 v82.87,70.48
SIG_2  (via drill 0.6)
  Top 0.61: IC3.6 36.2,27.94 36.51,27.62 37.47,27.62 38.73,26.35 38.73,24.45 28.89,14.61 28.26,14.61 26.35,12.7 v26.35,12.06 | v39.37,12.06 45.4,18.1 79.38,18.1 82.23,20.95 82.23,32.38 | 82.23,32.38 v80.64,32.38 | 82.23,32.38 82.23,69.22 80.96,70.48 v76.83,70.48
  Bottom 0.61: v26.35,12.06 v39.37,12.06 | IC5.2 v80.64,32.38 | v76.83,70.48 IC4.1
VB
  Top 1.27: D7.C C13.+
  Bottom 0.406: 68.77,73.44 C11.1
  Bottom 0.813: 69.22,70.48 IC4.8 67.63,70.48 66.99,71.12 66.99,71.75 68.58,73.34 68.67,73.34 C11.1 68.98,74.06 69.85,74.93 69.85,91.76 C13.+
VB_2
  Top 1.27: D8.C C12.+
  Bottom 0.813: IC5.8 70.48,33.66 71.75,32.38 71.75,26.67 73.34,25.08 73.34,24.68 C10.1
  Bottom 1.016: C10.1 73.57,10.25 75.25,8.57 75.25,6.67 74.3,5.71 72.71,5.71 C12.+
VCC  (via drill 0.6)
  Top 0.61: IC3.14 29.84,34.92 | v26.99,29.84 26.99,32.07 27.94,33.02 28.89,33.02 29.84,33.97 IC3.14 | IC3.14 29.84,36.83 30.48,37.47 v32.7,37.47 | v15.56,14.29 IC2.14 15.56,17.78 15.24,18.1 13.34,18.1 12.06,19.37 12.06,28.26 13.34,29.53 20.32,29.53 v20.64,29.84 | R7.2 37.15,39.18 37.15,39.69 35.88,40.96 33.66,40.96 v32.7,40.01 | IC1.16 31.75,68.9 32.07,68.58 33.02,68.58 | R14.1 33.21,64 33.02,63.82
  Top 0.813: 18.57,84.61 18.73,84.45 20,84.45 20,85.72
  Top 1.016: v32.7,40.01 29.21,40.01 27.3,41.91 27.3,60.64 28.57,61.91 32.38,61.91 33.02,62.55 33.02,63.82 33.02,68.58 33.02,72.39 31.75,73.66 21.27,73.66 19.68,75.25 FREQ_FINE.1 FREQ_FINE.2 21.27,80.96 21.27,83.19 20,84.45
  Top 1.27: CON1.8 CON1.7 8.89,71.75 10.16,73.03 10.16,76.2 18.57,84.61 22.86,88.9 29.84,88.9 | IC7.3 39.37,83.82 38.1,85.09 33.34,85.09 29.84,88.58 29.84,88.9 | 29.84,88.9 J2.1
  Bottom 0.61: 26.35,31.11 IC8.14 24.77,31.11 23.5,29.84 v20.64,29.84 | 26.35,31.11 26.67,31.11 | 26.67,31.11 26.99,31.11 | 27.62,31.11 28.03,31.11 C22.1 | 26.99,30.48 v26.99,29.84 26.99,30.8 26.67,31.11 | 26.99,30.48 26.99,31.11 | 26.35,31.11 26.99,30.48 | 26.99,30.48 27.62,31.11 | 27.62,31.11 26.99,31.11 | C4.2 17.87,15.24 16.51,15.24 v15.56,14.29 | R12.2 32.57,38.87 32.7,38.73
  Bottom 0.813: v32.7,40.01 32.7,38.73 v32.7,37.47
  Bottom 1.27: C21.1 39.37,87 | 39.37,87 39.37,87.31 | 39.37,87 IC7.3
VCC/2  (via drill 0.6 pad 1.78)
  Top 1.27: CON1.10 CON1.9 8.26,76.83 19.68,88.27 | J1.2 19.68,88.27 | 19.68,88.27 21.91,90.49 | 22.23,90.81 20,90.81 19.68,90.49 19.68,89.85 20.64,89.85 21.27,90.49 21.91,90.49 | 21.91,90.49 22.23,90.81 | 22.23,90.81 26.67,90.81 27.3,91.44 IC6.3 | v51.44,95.25 53.77,95.25 D7.A | v52.39,7.62 D8.A
  Bottom 0.813: 69.22,29.84 IC5.5 67.94,29.84 67.31,29.21 67.31,28.26 | 68.9,5.08 68.9,8.26 70.8,10.16 70.8,20.95 68.9,22.86 68.9,26.67 67.94,27.62 | 68.9,5.08 68.9,4.13 | 68.9,5.08 69.53,4.45 | 68.9,5.08 68.26,4.45 | C1.1 68.26,63.82 67.31,64.77 67.31,66.04 67.94,66.67 IC4.5 71.12,66.67 71.75,67.31 71.75,71.12 72.39,71.75 73.03,71.75 73.66,72.39 73.66,75.25 72.39,76.52 72.39,89.53 75.56,92.71 C14.+ | 67.31,28.26 67.63,27.94 | 67.63,27.94 67.94,27.62 | C9.1 66.67,26.99 | 66.67,27.3 66.67,27.62 | 66.67,27.62 67.31,28.26 | 66.67,27.62 67.31,27.62 | 67.31,27.62 67.63,27.62 | 67.94,27.62 67.63,27.62 | 67.63,27.62 67.63,27.94 | 67.63,27.94 67.31,27.94 | 67.31,27.94 67.31,27.62 | 67.31,27.62 66.67,26.99 | 66.67,26.99 66.67,27.3 | 66.67,27.3 67.31,27.94
  Bottom 1.016: C18.1 34.52,94.39 34.92,93.98
  Bottom 1.27: IC6.3 34.92,93.98 38.1,93.98 39.37,92.71 | 39.37,92.71 40.01,92.08 | 40.01,92.08 40.64,91.44 | 40.64,91.44 41.91,90.17 | 41.91,90.17 46.35,90.17 | 48.26,92.08 46.35,90.17 | 46.35,90.17 C19.+ 48.26,92.08 | 48.26,92.08 v51.44,95.25 52.07,95.89 79.06,95.89 | 34.29,84.45 34.29,85.09 39.37,90.17 | 40.64,91.44 40.01,90.81 | 39.37,90.17 41.91,90.17 | 39.37,90.17 39.37,92.71 | 40.01,92.08 40.01,90.81 | 40.01,90.81 39.37,90.17 | 80.96,95.89 84.14,95.89 89.53,90.49 89.53,8.89 84.77,4.13 80.96,4.13 | 80.01,95.89 79.06,95.89 | C14.+ 80.01,94.93 | 80.01,94.93 80.01,95.89 | 80.01,94.93 80.96,95.89 | 80.96,95.89 80.01,95.89 | 79.06,95.89 80.01,94.93 | 78.74,4.13 68.9,4.13 55.88,4.13 v52.39,7.62 | C15.+ 80.01,5.4 | 80.01,5.4 78.74,4.13 | 78.74,4.13 80.96,4.13 | 80.96,4.13 80.96,4.45 80.01,5.4 | 80.01,5.4 80.01,4.45 | C20.1 33.25,83.59 33.34,83.5 | 33.34,83.5 IC7.1 34.29,84.45 | 33.34,83.5 34.29,84.45
VCC_IN  (via drill 0.6 pad 1.27)
  Top 1.778: C26.+ 38.1,48.26 41.91,44.45 v41.91,41.91 v41.91,40.01 v41.91,38.1
  Bottom 1.016: C7.1 33.42,58.97 33.34,59.05 | C27.1 v41.91,38.1
  Bottom 1.27: 31.75,59.05 30.48,60.33 | 30.48,60.33 29.21,60.33 | 29.21,60.33 28.26,59.37 | 28.26,59.37 28.26,58.42 28.89,57.78 30.16,57.78 | 30.16,57.78 31.11,58.74 31.11,59.05 31.43,58.74 31.43,58.42 30.8,57.78 30.16,57.78 | 28.26,59.37 28.26,59.69 28.89,60.33 29.21,60.33 | 30.48,60.33 30.8,60.33 31.43,59.69
  Bottom 1.778: C24.+ 31.11,59.05 31.75,59.05 33.34,59.05 34.92,59.05 40.64,64.77 40.64,73.66 44.45,77.47 Q1.D 55.99,77.47 D3.C | Q3.D 51.12,40.64 | Q3.D 55.99,40.64 D6.C | 41.91,39.37 v41.91,40.01 v41.91,41.91 43.18,40.64 | 43.18,40.64 41.91,39.37 | 41.91,39.37 v41.91,38.1 43.18,39.37 | 43.18,39.37 43.18,40.64 | 43.18,40.64 44.45,40.64 | 43.18,39.37 44.45,40.64 | 44.45,40.64 Q3.D
  Bottom 2.54: 13.97,59.05 15.24,59.05 | C24.+ C23.+ 15.24,59.05 | C26.+ C25.+ 13.34,53.34 | F1.2 10.34,56.34 10.79,55.88 | 10.79,55.88 12.06,54.61 | 13.97,59.05 13.34,58.42 | 10.79,55.88 12.06,57.15 | 12.06,55.88 12.06,54.61 | 12.06,54.61 13.34,53.34 | 13.34,53.34 13.34,58.42 | 15.24,59.05 12.06,55.88 | 12.06,55.88 12.06,57.15 | 12.06,57.15 13.34,58.42 | 13.97,59.05 12.7,59.05 | 10.16,56.52 12.7,59.05 | 12.7,59.05 11.43,59.05 | 11.43,59.05 8.89,56.52 | 11.43,59.05 8.26,59.05 5.71,56.52 9.53,56.52 9.53,57.78 10.16,58.42

### Text on the board
Bottom: Version 1.0 / Prj. 36 - Aug. 2019 | Simple Tesla Coil / @MoJoKi42 (GitHub)
Bestueckungsdruck: J1 | J2 | FREQ_FINE | HC4046 | FREQ | 74HC08 | 74HC14